# EAGLE design coupeDeFrance (EAGLE 9.0.0)
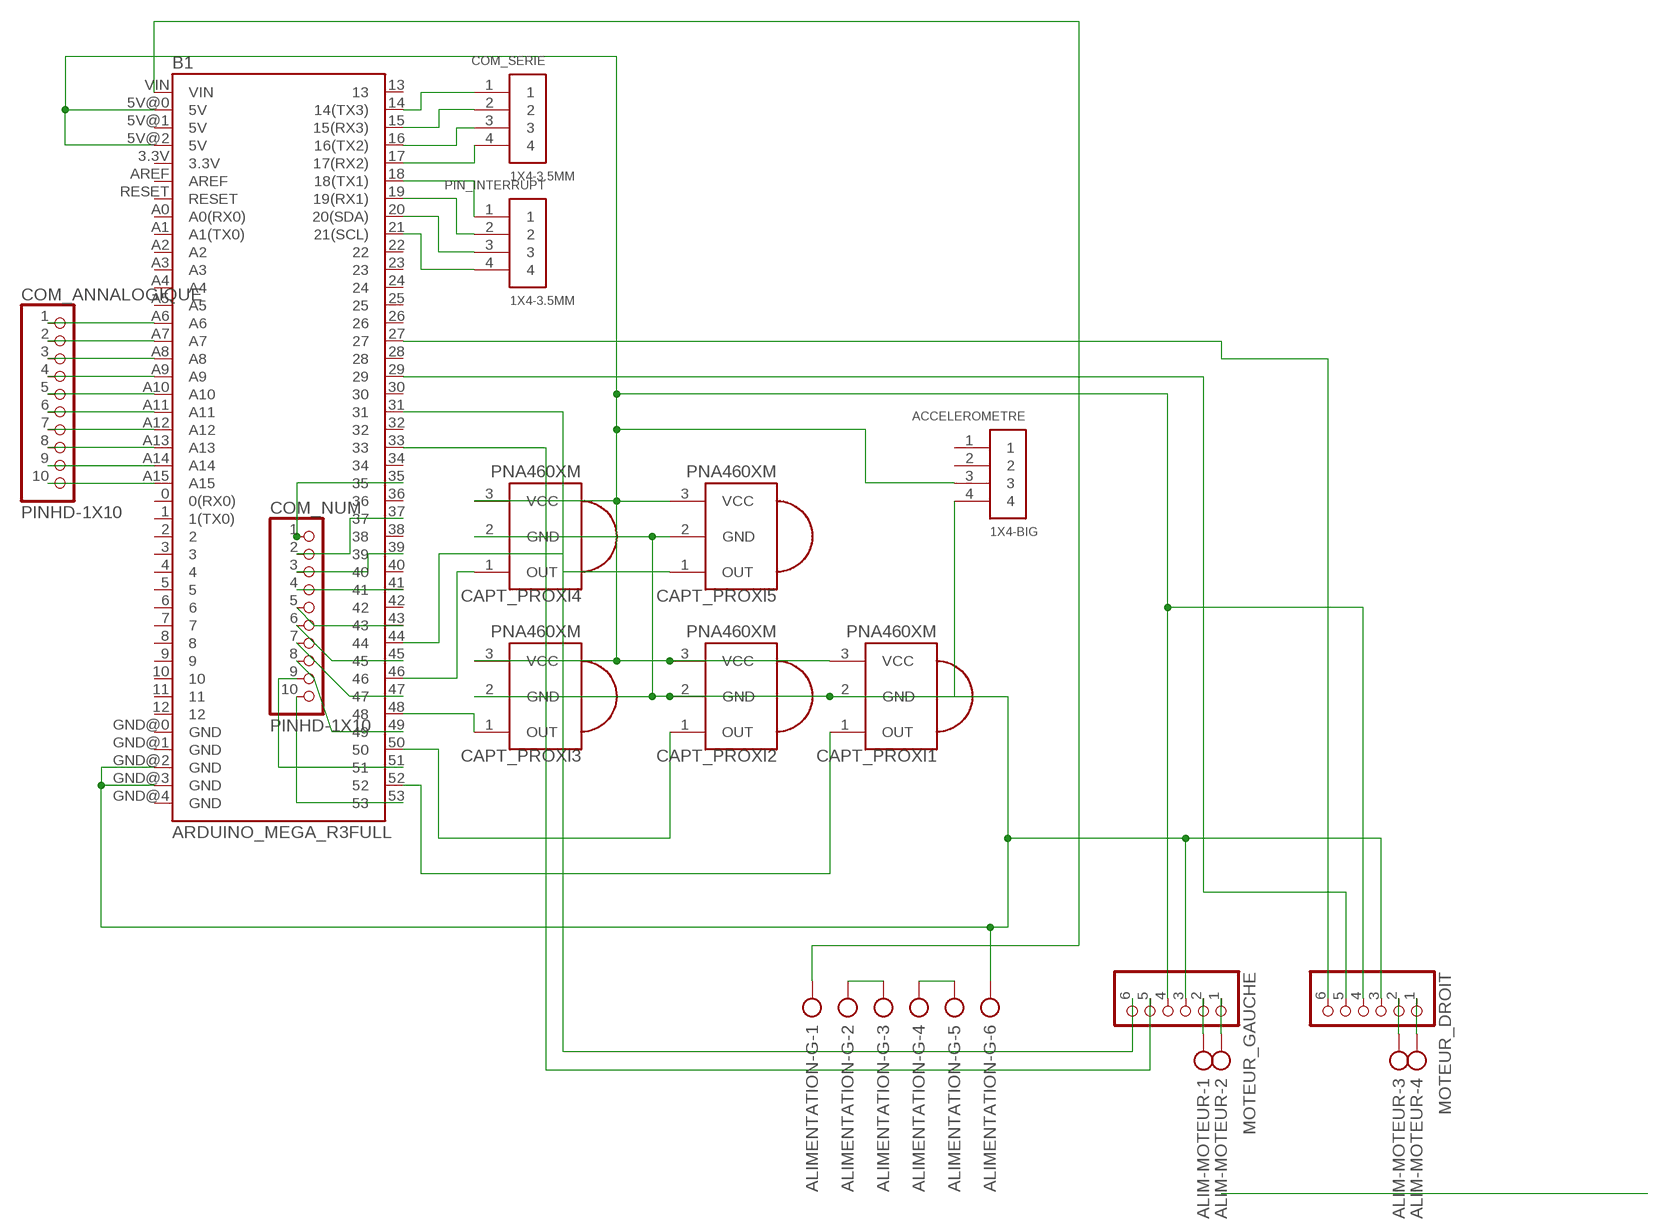
[diagram p0: schematic, sheet 1]

## Parts
ACCELEROMETRE  1X4-BIG  [1X04-BIG]
ALIM-MOTEUR  AK300/4  [AK300/4]
ALIMENTATION-G  AK300/6  [AK300/6]
B1  ARDUINO_MEGA_R3FULL  [ARDUINO_MEGA]
CAPT_PROXI1  PNA460XM  [PNA460XM]
CAPT_PROXI2  PNA460XM  [PNA460XM]
CAPT_PROXI3  PNA460XM  [PNA460XM]
CAPT_PROXI4  PNA460XM  [PNA460XM]
CAPT_PROXI5  PNA460XM  [PNA460XM]
COM_ANNALOGIQUE  PINHD-1X10  [1X10-BIG]
COM_NUM  PINHD-1X10  [1X10-BIG]
COM_SERIE  1X4-3.5MM  [1X04-3.5MM]
MOTEUR_DROIT  PINHD-1X6  [1X06]
MOTEUR_GAUCHE  PINHD-1X6  [1X06]
PIN_INTERRUPT  1X4-3.5MM  [1X04-3.5MM]

## Nets
N$1: ACCELEROMETRE.3 B1.5V@0(5V) B1.5V@2(5V) CAPT_PROXI1.3(VCC) CAPT_PROXI2.3(VCC) CAPT_PROXI3.3(VCC) CAPT_PROXI4.3(VCC) CAPT_PROXI5.3(VCC) MOTEUR_DROIT.4 MOTEUR_GAUCHE.4
N$2: B1.A15 COM_ANNALOGIQUE.10
N$3: B1.52 CAPT_PROXI1.1(OUT)
N$4: B1.50 CAPT_PROXI2.1(OUT)
N$5: B1.48 CAPT_PROXI3.1(OUT)
N$6: B1.46 CAPT_PROXI4.1(OUT)
N$7: B1.44 CAPT_PROXI5.1(OUT)
N$8: B1.A12 COM_ANNALOGIQUE.7
N$9: ALIMENTATION-G.2 ALIMENTATION-G.3
N$10: ALIMENTATION-G.4 ALIMENTATION-G.5
N$11: ALIM-MOTEUR.1 MOTEUR_GAUCHE.2
N$12: ALIM-MOTEUR.2 MOTEUR_GAUCHE.1
N$14: ALIM-MOTEUR.3 MOTEUR_DROIT.2
N$15: ALIMENTATION-G.1 B1.VIN
N$16: B1.A11 COM_ANNALOGIQUE.6
N$18: B1.A14 COM_ANNALOGIQUE.9
N$19: B1.A13 COM_ANNALOGIQUE.8
N$20: B1.A10 COM_ANNALOGIQUE.5
N$21: B1.A9 COM_ANNALOGIQUE.4
N$22: B1.A8 COM_ANNALOGIQUE.3
N$23: B1.A7 COM_ANNALOGIQUE.2
N$24: B1.A6 COM_ANNALOGIQUE.1
N$25: B1.53 COM_NUM.10
N$26: B1.51 COM_NUM.9
N$27: B1.49 COM_NUM.8
N$28: B1.47 COM_NUM.7
N$29: B1.45 COM_NUM.6
N$30: B1.43 COM_NUM.5
N$31: B1.41 COM_NUM.4
N$32: B1.39 COM_NUM.3
N$33: B1.37 COM_NUM.2
N$34: B1.35 COM_NUM.1
N$35: B1.14(14(TX3)) COM_SERIE.1
N$36: B1.15(15(RX3)) COM_SERIE.2
N$37: B1.16(16(TX2)) COM_SERIE.3
N$38: B1.17(17(RX2)) COM_SERIE.4
N$39: B1.18(18(TX1)) PIN_INTERRUPT.1
N$40: B1.19(19(RX1)) PIN_INTERRUPT.2
N$41: B1.20(20(SDA)) PIN_INTERRUPT.3
N$42: B1.21(21(SCL)) PIN_INTERRUPT.4
N$43: B1.33 MOTEUR_GAUCHE.5
N$44: B1.31 MOTEUR_GAUCHE.6
N$45: B1.29 MOTEUR_DROIT.5
N$46: B1.27 MOTEUR_DROIT.6
N$47: ALIM-MOTEUR.4 MOTEUR_DROIT.1
N$48: ACCELEROMETRE.4 ALIMENTATION-G.6 B1.GND@2(GND) B1.GND@3(GND) CAPT_PROXI1.2(GND) CAPT_PROXI2.2(GND) CAPT_PROXI3.2(GND) CAPT_PROXI4.2(GND) CAPT_PROXI5.2(GND) MOTEUR_DROIT.3 MOTEUR_GAUCHE.3
Unconnected: ACCELEROMETRE.1 ACCELEROMETRE.2 B1.0(0(RX0)) B1.1(1(TX0)) B1.2 B1.3 B1.3.3V B1.4 B1.5 B1.5V@1(5V) B1.6 B1.7 B1.8 B1.9 B1.10 B1.11 B1.12 B1.13 B1.22 B1.23 B1.24 B1.25 B1.26 B1.28 B1.30 B1.32 B1.34 B1.36 B1.38 B1.40 B1.42 B1.A0(A0(RX0)) B1.A1(A1(TX0)) B1.A2 B1.A3 B1.A4 B1.A5 B1.AREF B1.GND@0(GND) B1.GND@1(GND) B1.GND@4(GND) B1.RESET

## Library data of the parts
ACCELEROMETRE COM_SERIE PIN_INTERRUPT = adafruit:1X4: 4-pin connector
ALIM-MOTEUR = con-ptr500:AK300/4: CONNECTOR; OC_FARNELL: unknown; OC_NEWARK: unknown
ALIMENTATION-G = con-ptr500:AK300/6: CONNECTOR; OC_FARNELL: unknown; OC_NEWARK: unknown
B1 = SparkFun-Boards:ARDUINO_MEGA_R3: Arduino Mega R3 ATmega2560 R3 compatible footprint. SparkFun Products: Arduino Mega 2560 R3 <https://www.sparkfun.com/products/11061>
CAPT_PROXI1-CAPT_PROXI5 = adafruit:PNA460XM: IR 38KHz receiver PNA4602 and related receivers http://www.ladyada.net/library/pcb/eaglelibrary.html
COM_ANNALOGIQUE COM_NUM = adafruit:PINHD-1X10: Pin header 1x10 0.1" spacing With round pins
MOTEUR_DROIT MOTEUR_GAUCHE = adafruit:PINHD-1X6: PIN HEADER

## Board
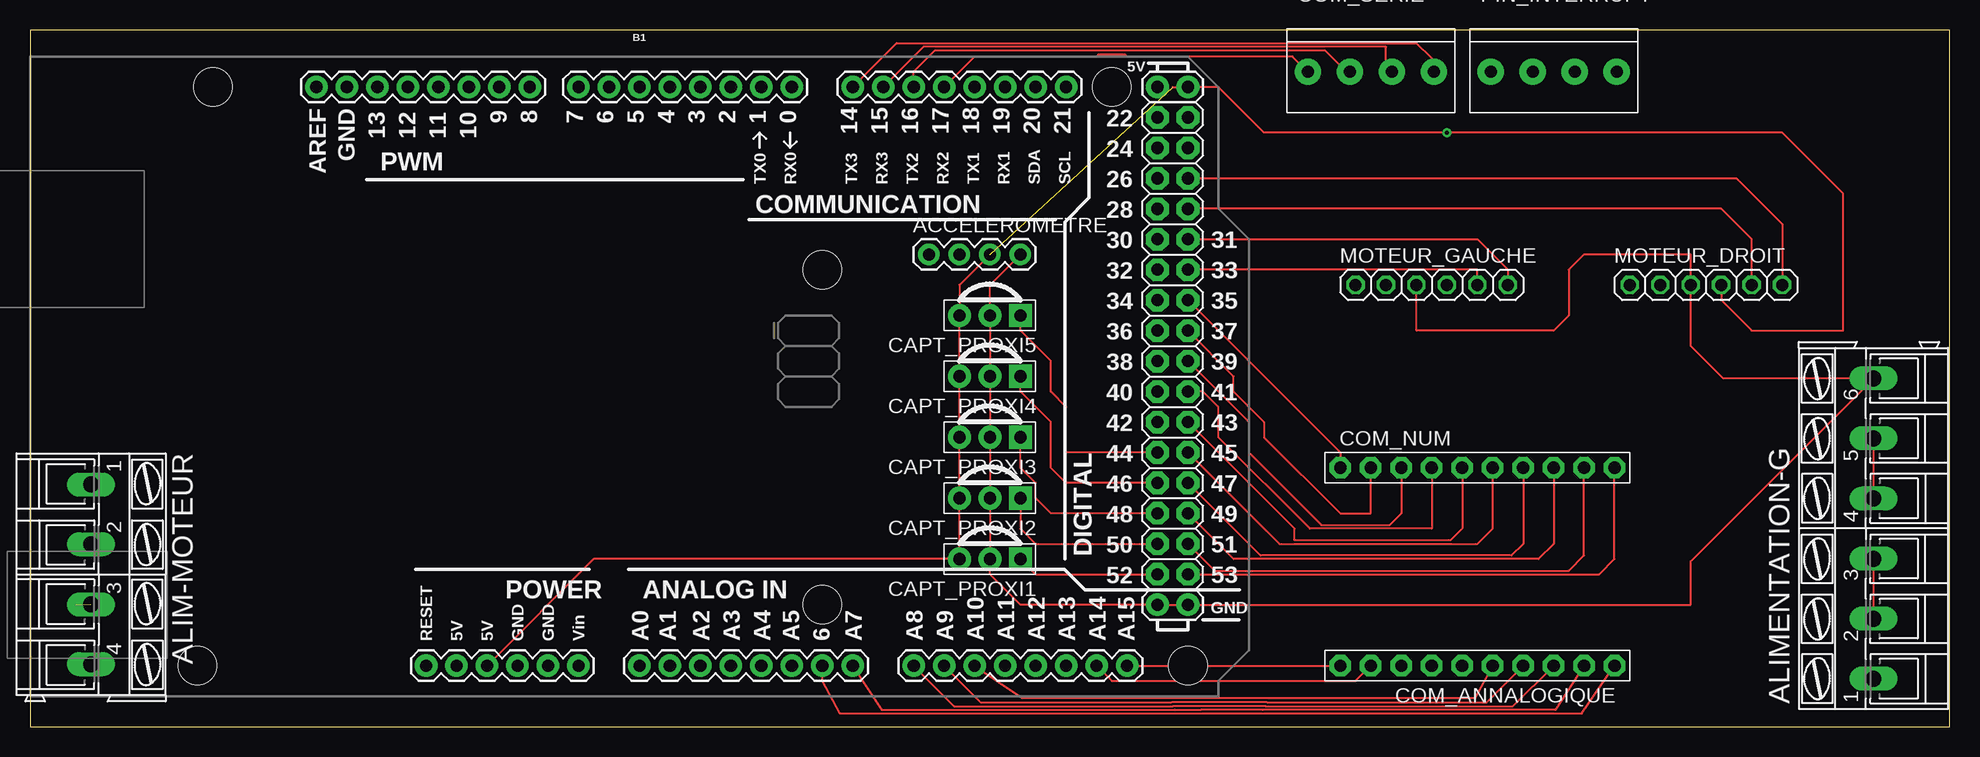
[diagram p1: board, top side]
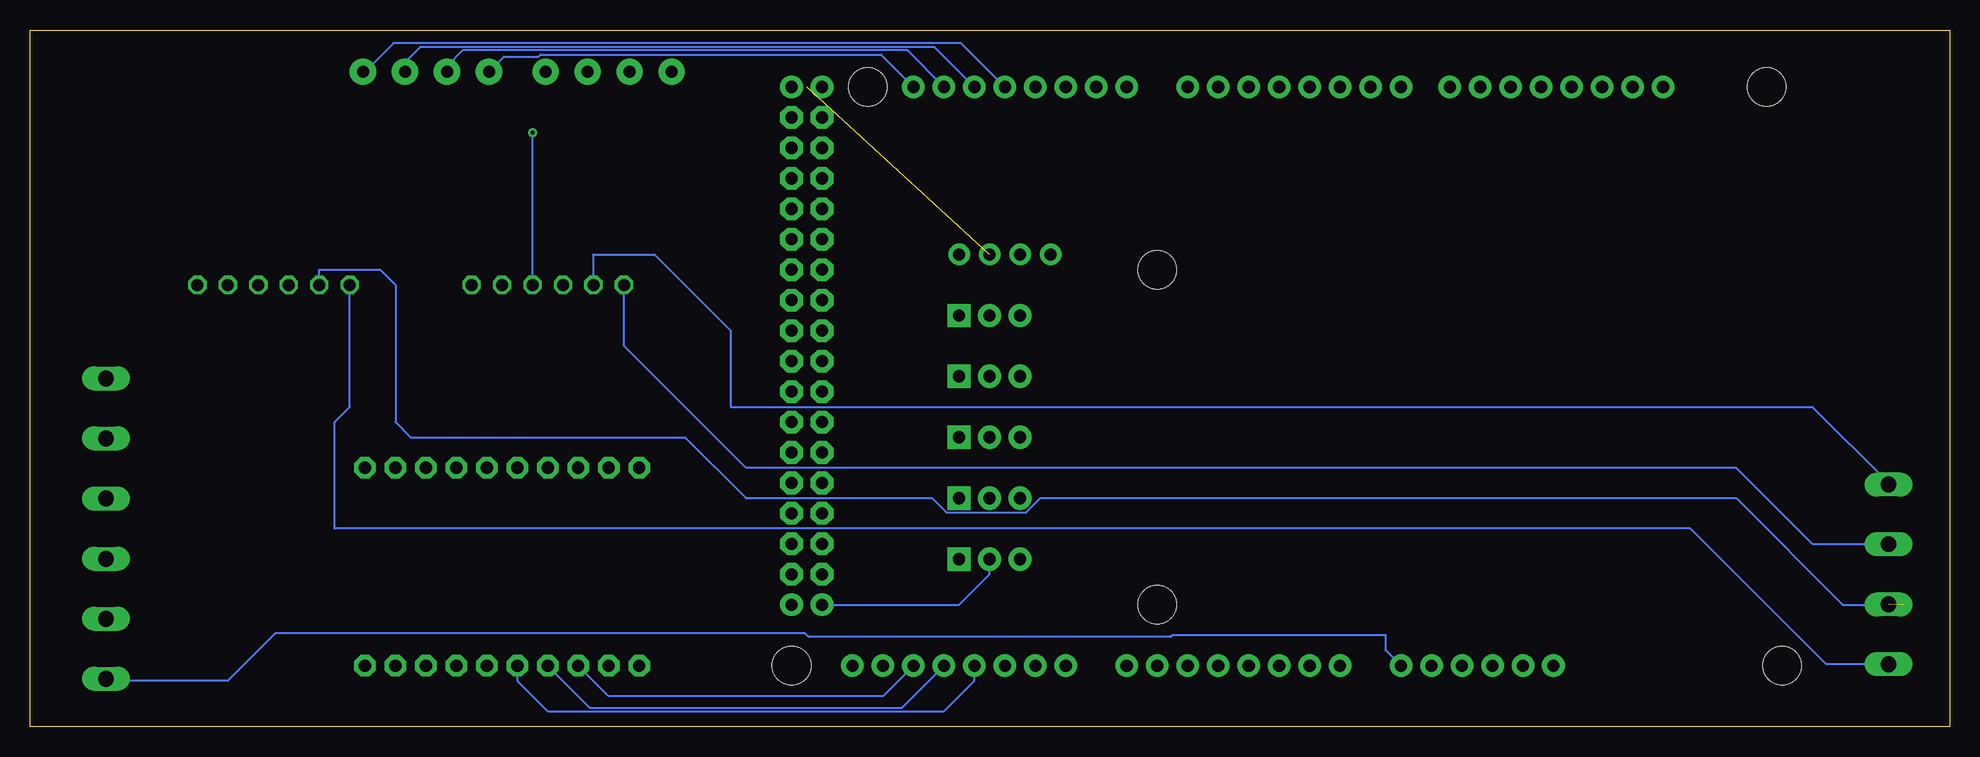
[diagram p2: board, bottom side, seen from below]

Size 160 x 58.09 mm. Coordinates in mm from the lower left corner, seen from the top.
Outline: 0,0 160,0 160,58.09 0,58.09 0,0
Copper layers (1*16): Top 0.035mm / dielectric 1.5mm / Bottom 0.035mm
Design rules "default": minimum track width 6mil, minimum drill 0.35mm, track to track 6mil, track to pad 6mil, pad to pad 6mil, via to via 6mil, smd to smd 6mil, copper to edge 40mil, drill to drill 6mil, minimum pad ring 10mil, minimum via ring 8mil, stop-mask expansion 4mil, vias tented up to drill 0mil, thermal gap 10mil

### Footprints (pad centres in the part's own frame; a part is rotated, then mirrored left to right if it is on the bottom)
1X04-BIG = drill 1.016 pad 1.778: 1 0,0; 2 2.54,0; 3 5.08,0; 4 7.62,0
AK300/4 = drill 1.321 long: 1 -7.493,0; 2 -2.515,0; 3 2.515,0; 4 7.493,0
AK300/6 = drill 1.321 long: 1 -12.522,0; 2 -7.518,0; 3 -2.515,0; 4 2.515,0; 5 7.518,0; 6 12.522,0
ARDUINO_MEGA = drill 1.016 pad 1.88: 0 13.97,24.13; 1 11.43,24.13; 2 8.89,24.13; 3 6.35,24.13; 3.3V -13.97,-24.13; 4 3.81,24.13; 5 1.27,24.13; 5V@0 -11.43,-24.13; 5V@1 44.45,24.13; 5V@2 46.99,24.13; 6 -1.27,24.13; 7 -3.81,24.13; 8 -7.874,24.13; 9 -10.414,24.13; 10 -12.954,24.13; 11 -15.494,24.13; 12 -18.034,24.13; 13 -20.574,24.13; 14 19.05,24.13; 15 21.59,24.13; 16 24.13,24.13; 17 26.67,24.13; 18 29.21,24.13; 19 31.75,24.13; 20 34.29,24.13; 21 36.83,24.13; A0 1.27,-24.13; A1 3.81,-24.13; A2 6.35,-24.13; A3 8.89,-24.13; A4 11.43,-24.13; A5 13.97,-24.13; A6 16.51,-24.13; A7 19.05,-24.13; A8 24.13,-24.13; A9 26.67,-24.13; A10 29.21,-24.13; A11 31.75,-24.13; A12 34.29,-24.13; A13 36.83,-24.13; A14 39.37,-24.13; A15 41.91,-24.13; AREF -25.654,24.13; GND@0 -8.89,-24.13; GND@1 -6.35,-24.13; GND@2 44.45,-19.05; GND@3 46.99,-19.05; GND@4 -23.114,24.13; RESET -16.51,-24.13; VIN -3.81,-24.13 | drill 1.016 pad 1.88 octagon: 22 44.45,21.59; 23 46.99,21.59; 24 44.45,19.05; 25 46.99,19.05; 26 44.45,16.51; 27 46.99,16.51; 28 44.45,13.97; 29 46.99,13.97; 30 44.45,11.43; 31 46.99,11.43; 32 44.45,8.89; 33 46.99,8.89; 34 44.45,6.35; 35 46.99,6.35; 36 44.45,3.81; 37 46.99,3.81; 38 44.45,1.27; 39 46.99,1.27; 40 44.45,-1.27; 41 46.99,-1.27; 42 44.45,-3.81; 43 46.99,-3.81; 44 44.45,-6.35; 45 46.99,-6.35; 46 44.45,-8.89; 47 46.99,-8.89; 48 44.45,-11.43; 49 46.99,-11.43; 50 44.45,-13.97; 51 46.99,-13.97; 52 44.45,-16.51; 53 46.99,-16.51 | hole 3.2: -34.29,24.13; -35.56,-24.13; 16.51,8.89; 16.51,-19.05; 40.64,24.13; 46.99,-24.13
PNA460XM = drill 1.016 pad 1.93 square: 1 -2.54,0 | drill 1.016 pad 1.93: 2 0,0; 3 2.54,0
1X10-BIG = drill 1.016 pad 1.778 octagon: 1 -11.43,0; 2 -8.89,0; 3 -6.35,0; 4 -3.81,0; 5 -1.27,0; 6 1.27,0; 7 3.81,0; 8 6.35,0; 9 8.89,0; 10 11.43,0
1X04-3.5MM = drill 1 pad 2.184: 1 -5.25,0; 2 -1.75,0; 3 1.75,0; 4 5.25,0
1X06 = drill 1.016 octagon: 1 -6.35,0; 2 -3.81,0; 3 -1.27,0; 4 1.27,0; 5 3.81,0; 6 6.35,0

### Placement (x,y rotation side)
ACCELEROMETRE  74.93,39.37 0 top
ALIM-MOTEUR  5.08,12.7 270 top
ALIMENTATION-G  153.67,16.51 90 top
B1  49.53,29.21 0 top
CAPT_PROXI1  80.01,13.97 180 top
CAPT_PROXI2  80.01,19.05 180 top
CAPT_PROXI3  80.01,24.13 180 top
CAPT_PROXI4  80.01,29.21 180 top
CAPT_PROXI5  80.01,34.29 180 top
COM_ANNALOGIQUE  120.65,5.08 180 top
COM_NUM  120.65,21.59 0 top
COM_SERIE  111.76,54.61 180 top
MOTEUR_DROIT  139.7,36.83 0 top
MOTEUR_GAUCHE  116.84,36.83 0 top
PIN_INTERRUPT  127,54.61 180 top

### Tracks (layer width: path | path; a pad name or v marks a point on that pad's centre or on a via)
N$1  (via drill 0.35)  (1 unrouted)
  Top 0.152: ACCELEROMETRE.3 77.47,36.83 CAPT_PROXI5.3 CAPT_PROXI4.3 CAPT_PROXI3.3 CAPT_PROXI2.3 CAPT_PROXI1.3 46.99,13.97 B1.5V@0 | MOTEUR_DROIT.4 140.97,35.56 143.51,33.02 151.13,33.02 151.13,44.45 146.05,49.53 v118.11,49.53 102.87,49.53 99.06,53.34 B1.5V@2 95.25,53.34
  Bottom 0.152: MOTEUR_GAUCHE.4 v118.11,49.53
N$2
  Top 0.152: B1.A15 COM_ANNALOGIQUE.10
N$3
  Top 0.152: CAPT_PROXI1.1 83.82,12.7 B1.52
N$4
  Top 0.152: CAPT_PROXI2.1 82.55,16.51 83.82,15.24 B1.50
N$5
  Top 0.152: B1.48 85.09,17.78 83.82,19.05 83.82,20.32 82.55,21.59 CAPT_PROXI3.1
N$6
  Top 0.152: B1.46 86.36,20.32 85.09,21.59 85.09,25.4 82.55,27.94 CAPT_PROXI4.1
N$7
  Top 0.152: B1.44 86.36,22.86 86.36,26.67 85.09,27.94 85.09,30.48 82.55,33.02 CAPT_PROXI5.1
N$8
  Bottom 0.152: COM_ANNALOGIQUE.7 113.33,1.57 87.33,1.57 B1.A12
N$9
  Top 0.152: ALIMENTATION-G.2 ALIMENTATION-G.3
N$10
  Top 0.152: ALIMENTATION-G.4 ALIMENTATION-G.5
N$11
  Bottom 0.152: MOTEUR_GAUCHE.2 113.03,39.37 107.95,39.37 101.6,33.02 101.6,26.67 11.43,26.67 5.08,20.32 ALIM-MOTEUR.1
N$12
  Bottom 0.152: ALIM-MOTEUR.2 11.4,15.21 17.78,21.59 100.33,21.59 110.49,31.75 MOTEUR_GAUCHE.1
N$14  (1 unrouted)
  Bottom 0.152: MOTEUR_DROIT.2 135.89,38.1 130.81,38.1 129.54,36.83 129.54,25.4 128.27,24.13 105.41,24.13 100.33,19.05 84.8,19.05 83.61,17.86 76.98,17.86 75.78,19.05 17.78,19.05 8.89,10.16 3.81,10.16
N$15
  Bottom 0.152: B1.VIN 46.99,6.35 46.99,7.62 64.77,7.62 64.92,7.47 95.1,7.47 95.41,7.77 139.55,7.77 143.51,3.81 153.49,3.81 ALIMENTATION-G.1
N$16
  Bottom 0.152: COM_ANNALOGIQUE.6 119.38,3.81 116.84,1.27 83.82,1.27 81.28,3.81 B1.A11
N$18
  Top 0.152: COM_ANNALOGIQUE.9 110.49,3.81 90.17,3.81 B1.A14
N$19
  Bottom 0.152: B1.A13 88.9,2.54 111.76,2.54 COM_ANNALOGIQUE.8
N$20
  Top 0.152: B1.A10 82.7,2.39 120.5,2.39 COM_ANNALOGIQUE.5
N$21
  Top 0.152: COM_ANNALOGIQUE.4 121.39,2.01 103.12,2.01 103.09,2.03 95.15,2.03 95.13,2.01 79.27,2.01 B1.A9
N$22
  Top 0.152: B1.A8 77.04,1.7 95.25,1.7 95.28,1.73 102.97,1.73 102.99,1.7 123.62,1.7 COM_ANNALOGIQUE.3
N$23
  Top 0.152: COM_ANNALOGIQUE.2 127.13,1.4 102.74,1.4 97.64,1.42 95.41,1.42 95.38,1.4 70.99,1.4 B1.A7
N$24
  Top 0.152: B1.A6 66.04,3.81 67.49,1.09 129.36,1.09 COM_ANNALOGIQUE.1
N$25
  Top 0.152: B1.53 130.81,12.7 132.08,13.97 COM_NUM.10
N$26
  Top 0.152: B1.51 98.75,13 128.27,13 129.54,14.28 COM_NUM.9
N$27
  Top 0.152: COM_NUM.8 127,15.24 125.73,13.97 100.33,13.97 B1.49
N$28
  Top 0.152: COM_NUM.7 124.46,15.24 123.5,14.28 102.56,14.28 B1.47
N$29
  Top 0.152: B1.45 104.14,15.24 120.65,15.24 121.92,16.51 COM_NUM.6 121.92,20.32
N$30
  Top 0.152: COM_NUM.5 119.38,16.51 118.42,15.54 105.41,15.54 105.41,16.51 B1.43
N$31
  Top 0.152: COM_NUM.4 116.84,16.51 106.68,16.51 99.06,24.13 99.06,26.67 97.79,27.94 B1.41
N$32
  Top 0.152: COM_NUM.3 114.3,17.78 113.33,16.82 107.64,16.82 101.6,22.86 101.6,25.4 B1.39
N$33
  Top 0.152: COM_NUM.2 111.76,17.78 109.22,17.78 102.87,24.13 102.87,25.4 100.33,27.94 100.33,29.21 B1.37
N$34
  Top 0.152: B1.35 109.22,22.86 COM_NUM.1
N$35
  Top 0.152: B1.14 72.24,57 115.57,57 116.84,55.73 116.84,54.61 COM_SERIE.1
N$36
  Top 0.152: COM_SERIE.2 113.03,55.09 113.03,56.69 74.47,56.69 B1.15
N$37
  Top 0.152: B1.16 73.66,54.61 75.44,56.39 107.95,56.39 109.73,54.61 COM_SERIE.3
N$38
  Top 0.152: COM_SERIE.4 105.24,55.88 91.44,55.88 91.28,56.03 89.06,56.03 88.9,55.88 78.74,55.88 B1.17
N$39
  Bottom 0.152: B1.18 82.4,57 129.69,57 132.08,54.61 PIN_INTERRUPT.1
N$40
  Bottom 0.152: PIN_INTERRUPT.2 128.75,55.4 127.46,56.69 84.63,56.69 B1.19
N$41
  Bottom 0.152: B1.20 86.87,56.39 123.95,56.39 125.25,55.09 PIN_INTERRUPT.3
N$42
  Bottom 0.152: PIN_INTERRUPT.4 120.48,55.88 117.61,55.88 117.46,56.03 89.05,56.03 B1.21
N$43
  Top 0.152: MOTEUR_GAUCHE.5 120.65,38.1 B1.33
N$44
  Top 0.152: B1.31 120.65,40.64 123.19,38.1 MOTEUR_GAUCHE.6
N$45
  Top 0.152: MOTEUR_DROIT.5 143.51,40.64 140.97,43.18 B1.29
N$46
  Top 0.152: B1.27 142.24,45.72 146.05,41.91 MOTEUR_DROIT.6
N$47
  Bottom 0.152: ALIM-MOTEUR.4 10.29,5.21 21.59,16.51 134.62,16.51 134.62,25.4 133.35,26.67 MOTEUR_DROIT.1
N$48
  Top 0.152: ACCELEROMETRE.4 80.01,36.83 CAPT_PROXI5.2 CAPT_PROXI4.2 CAPT_PROXI3.2 CAPT_PROXI2.2 CAPT_PROXI1.2 80.01,12.7 82.55,10.16 B1.GND@2 B1.GND@3 138.43,10.16 138.43,13.79 ALIMENTATION-G.6 141.15,29.03 138.43,31.75 MOTEUR_DROIT.3 138.43,39.37 129.54,39.37 128.27,38.1 128.27,34.29 127,33.02 115.57,33.02 MOTEUR_GAUCHE.3
  Bottom 0.152: B1.GND@2 82.55,10.16 80.01,12.7 CAPT_PROXI1.2